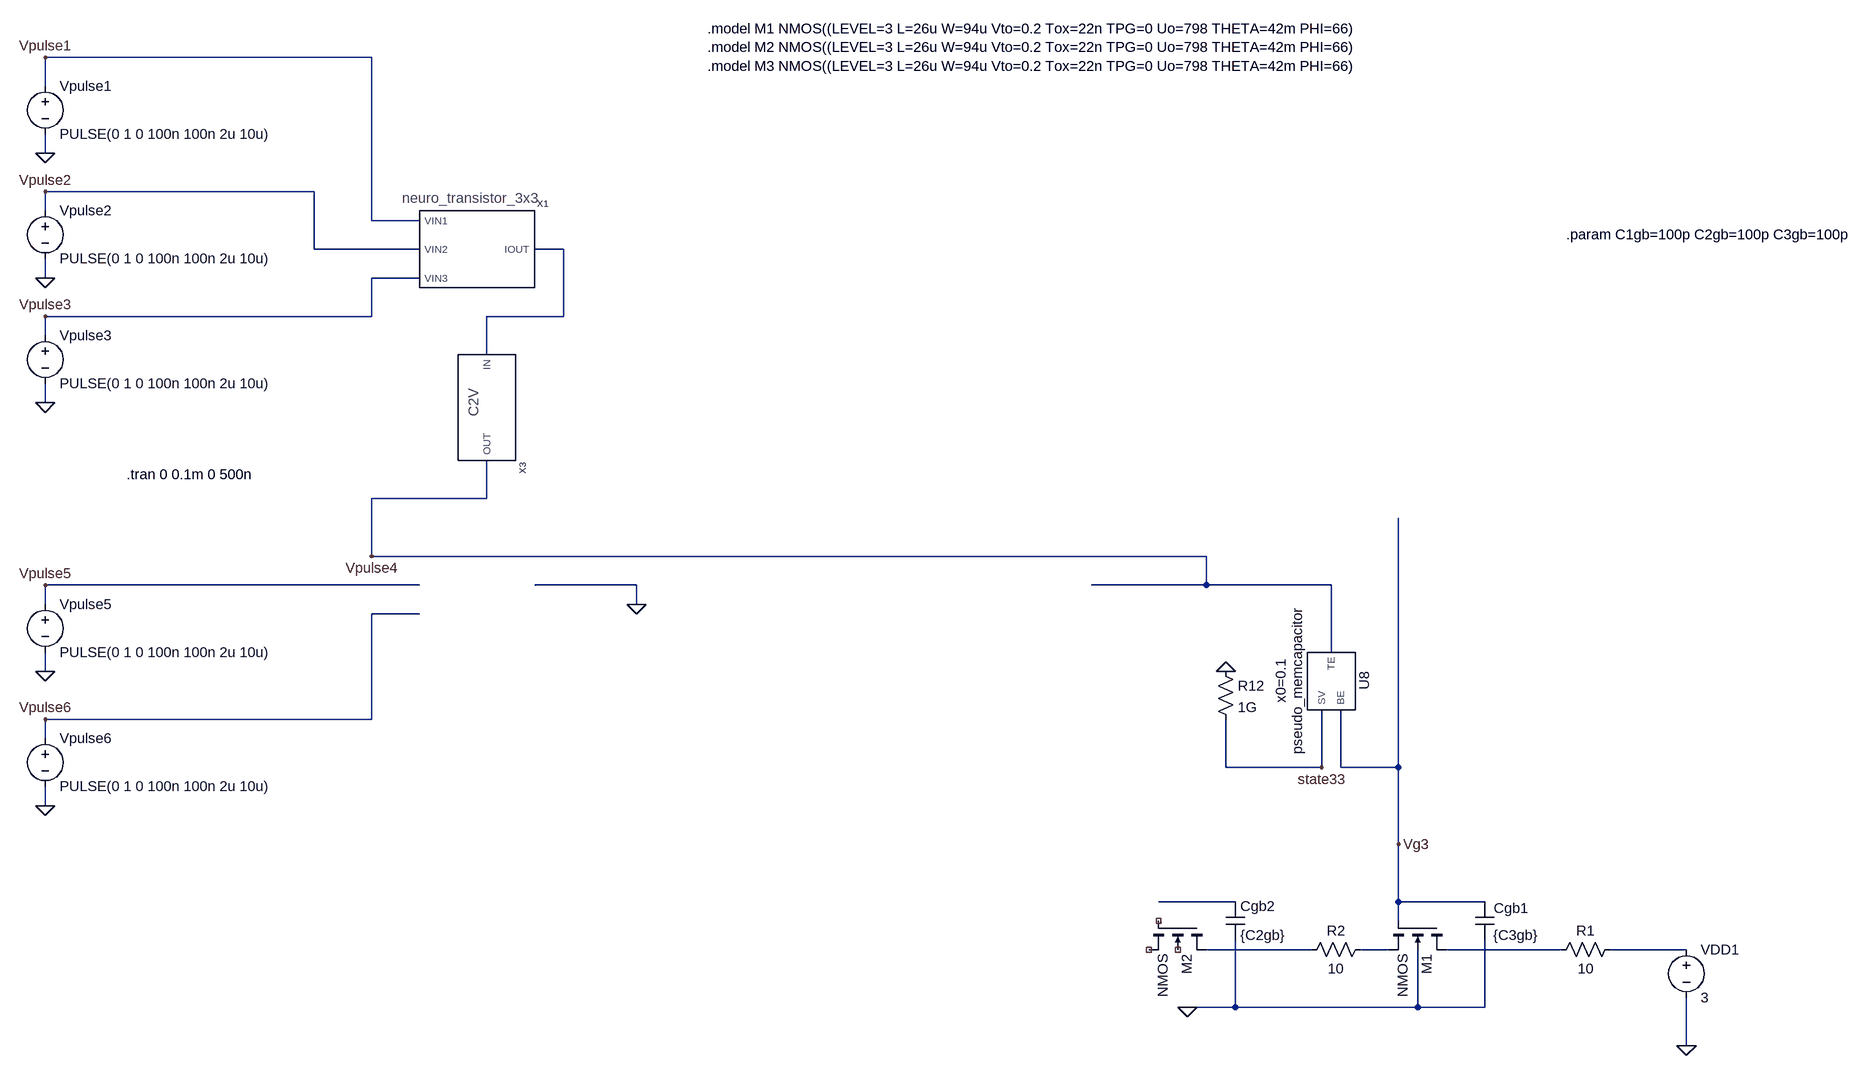
[diagram p0: schematic cascade_neuro_transistor_new.asc]
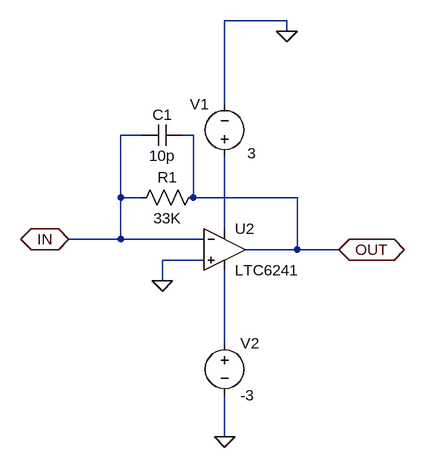
[diagram p1: sub-circuit current_to_voltage.asc]
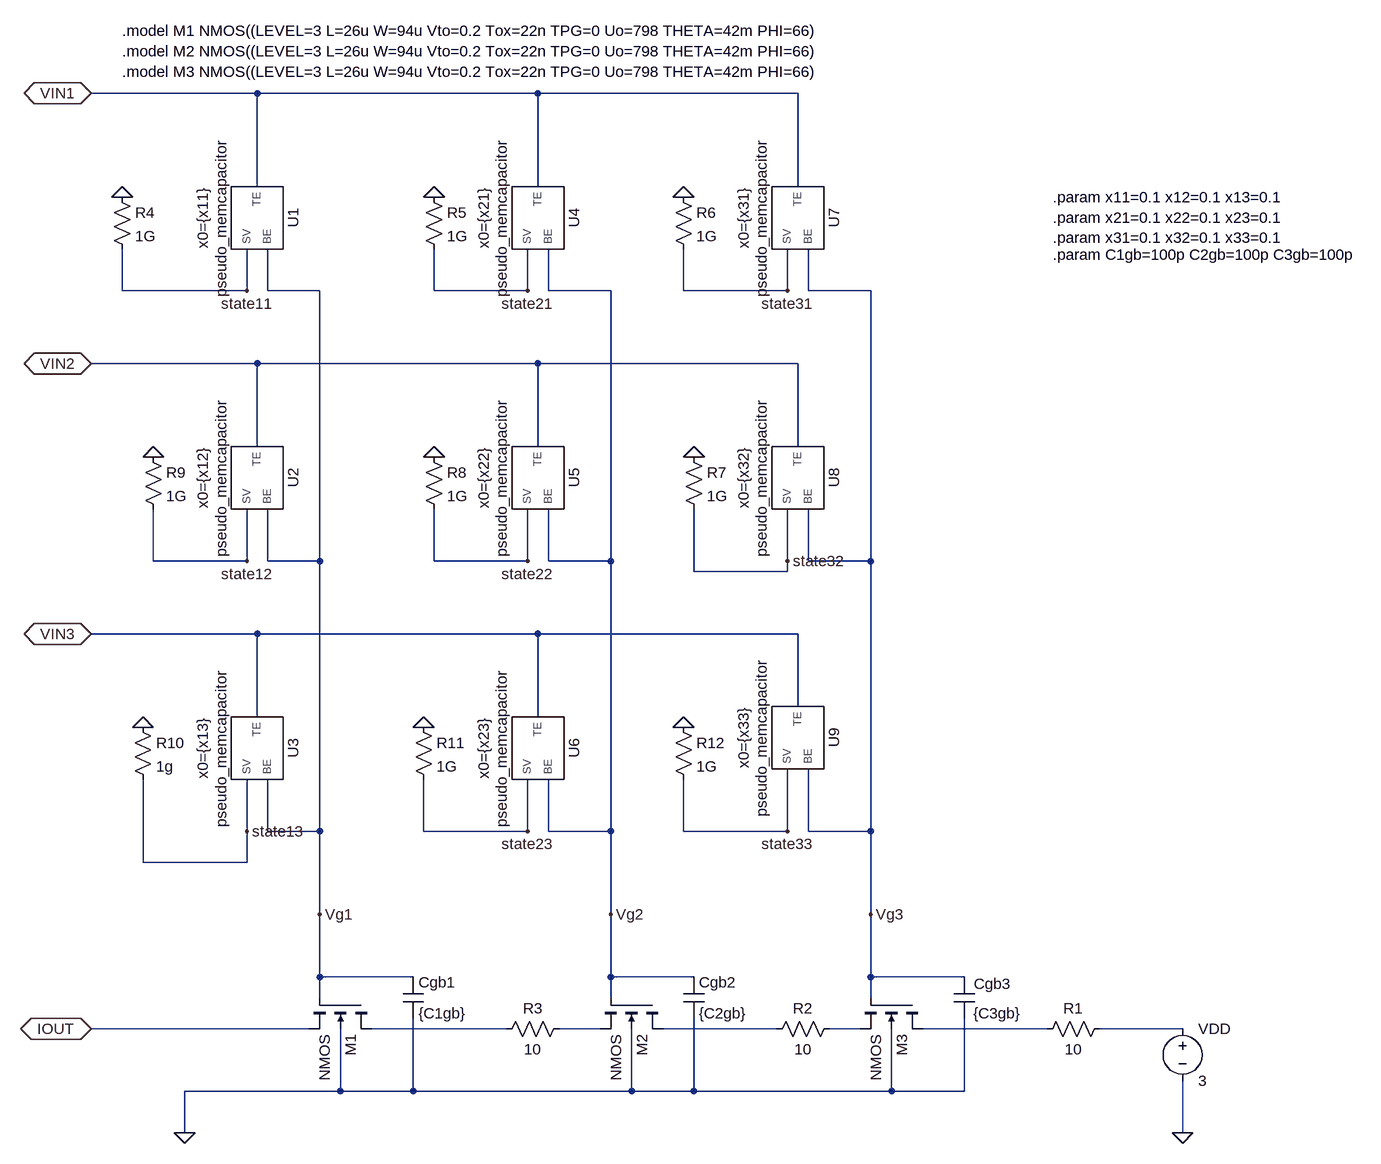
[diagram p2: sub-circuit neuro_memristor_3x3.asc]
cascade_neuro_transistor_new.asc, the LTspice schematic file:
Version 4
SHEET 1 3620 3476
WIRE 624 -16 80 -16
WIRE 80 32 80 -16
WIRE 80 144 80 112
WIRE 528 208 80 208
WIRE 80 240 80 208
WIRE 624 256 624 -16
WIRE 704 256 624 256
WIRE 528 304 528 208
WIRE 704 304 528 304
WIRE 944 304 896 304
WIRE 80 352 80 320
WIRE 704 352 624 352
WIRE 624 416 624 352
WIRE 624 416 80 416
WIRE 944 416 944 304
WIRE 944 416 816 416
WIRE 80 448 80 416
WIRE 816 480 816 416
WIRE 80 560 80 528
WIRE 816 720 816 656
WIRE 816 720 624 720
WIRE 624 816 624 720
WIRE 2256 816 624 816
WIRE 704 864 80 864
WIRE 1104 864 896 864
WIRE 2256 864 2256 816
WIRE 2256 864 2064 864
WIRE 2464 864 2256 864
WIRE 80 896 80 864
WIRE 1104 896 1104 864
WIRE 704 912 624 912
WIRE 2464 976 2464 864
WIRE 80 1008 80 976
WIRE 624 1088 624 912
WIRE 624 1088 80 1088
WIRE 80 1120 80 1088
WIRE 2288 1168 2288 1088
WIRE 2448 1168 2448 1072
WIRE 2448 1168 2288 1168
WIRE 2480 1168 2480 1072
WIRE 2576 1168 2576 752
WIRE 2576 1168 2480 1168
WIRE 80 1232 80 1200
WIRE 2576 1296 2576 1168
WIRE 2304 1392 2176 1392
WIRE 2576 1392 2576 1296
WIRE 2720 1392 2576 1392
WIRE 2576 1424 2576 1392
WIRE 2432 1472 2256 1472
WIRE 2560 1472 2512 1472
WIRE 2848 1472 2656 1472
WIRE 3056 1472 2928 1472
WIRE 2224 1568 2208 1568
WIRE 2304 1568 2304 1456
WIRE 2304 1568 2224 1568
WIRE 2608 1568 2608 1472
WIRE 2608 1568 2304 1568
WIRE 2720 1568 2720 1456
WIRE 2720 1568 2608 1568
WIRE 3056 1632 3056 1552
FLAG 80 144 0
FLAG 80 -16 Vpulse1
FLAG 80 352 0
FLAG 80 560 0
FLAG 80 208 Vpulse2
FLAG 80 416 Vpulse3
FLAG 80 1008 0
FLAG 80 1232 0
FLAG 80 864 Vpulse5
FLAG 80 1088 Vpulse6
FLAG 624 816 Vpulse4
FLAG 1104 896 0
FLAG 3056 1632 0
FLAG 2576 1296 Vg3
FLAG 2448 1168 state33
FLAG 2288 1008 0
FLAG 2224 1568 0
SYMBOL voltage 80 16 R0
WINDOW 123 0 0 Left 0
WINDOW 39 0 0 Left 0
SYMATTR InstName Vpulse1
SYMATTR Value PULSE(0 1 0 100n 100n 2u 10u)
SYMBOL voltage 80 224 R0
SYMATTR InstName Vpulse2
SYMATTR Value PULSE(0 1 0 100n 100n 2u 10u)
SYMBOL voltage 80 432 R0
SYMATTR InstName Vpulse3
SYMATTR Value PULSE(0 1 0 100n 100n 2u 10u)
SYMBOL voltage 80 880 R0
SYMATTR InstName Vpulse5
SYMATTR Value PULSE(0 1 0 100n 100n 2u 10u)
SYMBOL voltage 80 1104 R0
SYMATTR InstName Vpulse6
SYMATTR Value PULSE(0 1 0 100n 100n 2u 10u)
SYMBOL current_to_voltage 816 560 R90
SYMATTR InstName X3
SYMATTR SpiceModel C2V
SYMBOL neuro_memristor_3x3 800 304 R0
SYMATTR SpiceModel neuro_memristor_3x3
SYMATTR InstName X1
SYMBOL voltage 3056 1456 R0
SYMATTR InstName VDD1
SYMATTR Value 3
SYMBOL nmos4 2656 1424 R90
SYMATTR InstName M1
SYMBOL cap 2704 1392 R0
WINDOW 0 31 11 Left 2
WINDOW 3 30 56 Left 2
SYMATTR InstName Cgb1
SYMATTR Value {C3gb}
SYMBOL pseudo_memcapacitor 2464 1024 R90
WINDOW 123 0 68 Top 2
SYMATTR Value2 x0=0.1
SYMATTR InstName U8
SYMBOL nmos4 2256 1424 R90
SYMATTR InstName M2
SYMBOL cap 2288 1392 R0
SYMATTR InstName Cgb2
SYMATTR Value {C2gb}
SYMBOL res 2944 1456 R90
WINDOW 0 0 56 VBottom 2
WINDOW 3 32 56 VTop 2
SYMATTR InstName R1
SYMATTR Value 10
SYMBOL res 2528 1456 R90
WINDOW 0 0 56 VBottom 2
WINDOW 3 32 56 VTop 2
SYMATTR InstName R2
SYMATTR Value 10
SYMBOL res 2272 992 R0
SYMATTR InstName R12
SYMATTR Value 1G
TEXT 216 680 Left 2 !.tran 0 0.1m 0 500n
TEXT 1424 -64 Left 2 !.model M1 NMOS((LEVEL=3 L=26u W=94u Vto=0.2 Tox=22n TPG=0 Uo=798 THETA=42m PHI=66)\n.model M2 NMOS((LEVEL=3 L=26u W=94u Vto=0.2 Tox=22n TPG=0 Uo=798 THETA=42m PHI=66)\n.model M3 NMOS((LEVEL=3 L=26u W=94u Vto=0.2 Tox=22n TPG=0 Uo=798 THETA=42m PHI=66)
TEXT 2856 280 Left 2 !.param C1gb=100p C2gb=100p C3gb=100p

current_to_voltage.asc, the sub-circuit schematic file:
Version 4
SHEET 1 880 680
WIRE 320 -192 224 -192
WIRE 320 -176 320 -192
WIRE 224 -64 224 -192
WIRE 96 -16 64 -16
WIRE 176 -16 160 -16
WIRE 64 80 64 -16
WIRE 96 80 64 80
WIRE 176 80 176 -16
WIRE 336 80 176 80
WIRE 224 128 224 16
WIRE 64 144 64 80
WIRE 64 144 -16 144
WIRE 192 144 64 144
WIRE 336 160 336 80
WIRE 336 160 256 160
WIRE 400 160 336 160
WIRE 192 176 128 176
WIRE 128 208 128 176
WIRE 224 304 224 192
WIRE 224 448 224 384
FLAG 128 208 0
FLAG 320 -176 0
FLAG 224 448 0
FLAG -16 144 IN
IOPIN -16 144 BiDir
FLAG 400 160 OUT
IOPIN 400 160 BiDir
SYMBOL voltage 224 32 R180
WINDOW 0 24 96 Left 2
WINDOW 3 -49 20 Left 2
WINDOW 123 0 0 Left 0
WINDOW 39 0 0 Left 0
SYMATTR InstName V1
SYMATTR Value 3
SYMBOL voltage 224 288 R0
WINDOW 123 0 0 Left 0
WINDOW 39 0 0 Left 0
SYMATTR InstName V2
SYMATTR Value -3
SYMBOL res 192 64 R90
WINDOW 0 0 56 VBottom 2
WINDOW 3 32 56 VTop 2
SYMATTR InstName R1
SYMATTR Value 33K
SYMBOL OpAmps\\LTC6241 224 160 R0
SYMATTR InstName U2
SYMBOL cap 160 -32 R90
WINDOW 0 0 32 VBottom 2
WINDOW 3 32 32 VTop 2
SYMATTR InstName C1
SYMATTR Value 10p

neuro_memristor_3x3.asc, the sub-circuit schematic file:
Version 4
SHEET 1 2604 1572
WIRE 864 -208 608 -208
WIRE 1296 -208 864 -208
WIRE 1696 -208 1296 -208
WIRE 864 -64 864 -208
WIRE 1296 -64 1296 -208
WIRE 1696 -64 1696 -208
WIRE 656 96 656 32
WIRE 848 96 848 32
WIRE 848 96 656 96
WIRE 880 96 880 32
WIRE 960 96 880 96
WIRE 1136 96 1136 32
WIRE 1280 96 1280 32
WIRE 1280 96 1136 96
WIRE 1312 96 1312 32
WIRE 1408 96 1312 96
WIRE 1520 96 1520 32
WIRE 1680 96 1680 32
WIRE 1680 96 1520 96
WIRE 1712 96 1712 32
WIRE 1808 96 1712 96
WIRE 864 208 608 208
WIRE 1296 208 864 208
WIRE 1696 208 1296 208
WIRE 864 336 864 208
WIRE 1296 336 1296 208
WIRE 1696 336 1696 208
WIRE 704 512 704 432
WIRE 848 512 848 432
WIRE 848 512 704 512
WIRE 880 512 880 432
WIRE 960 512 960 96
WIRE 960 512 880 512
WIRE 1136 512 1136 432
WIRE 1280 512 1280 432
WIRE 1280 512 1136 512
WIRE 1312 512 1312 432
WIRE 1408 512 1408 96
WIRE 1408 512 1312 512
WIRE 1680 512 1680 432
WIRE 1712 512 1712 432
WIRE 1808 512 1808 96
WIRE 1808 512 1712 512
WIRE 1536 528 1536 432
WIRE 1680 528 1680 512
WIRE 1680 528 1536 528
WIRE 864 624 608 624
WIRE 1296 624 864 624
WIRE 1696 624 1296 624
WIRE 1696 736 1696 624
WIRE 864 752 864 624
WIRE 1296 752 1296 624
WIRE 848 928 848 848
WIRE 880 928 880 848
WIRE 960 928 960 512
WIRE 960 928 880 928
WIRE 1120 928 1120 848
WIRE 1280 928 1280 848
WIRE 1280 928 1120 928
WIRE 1312 928 1312 848
WIRE 1408 928 1408 512
WIRE 1408 928 1312 928
WIRE 1520 928 1520 848
WIRE 1680 928 1680 832
WIRE 1680 928 1520 928
WIRE 1712 928 1712 832
WIRE 1808 928 1808 512
WIRE 1808 928 1712 928
WIRE 688 976 688 848
WIRE 848 976 848 928
WIRE 848 976 688 976
WIRE 960 1056 960 928
WIRE 1408 1056 1408 928
WIRE 1808 1056 1808 928
WIRE 960 1152 960 1056
WIRE 1104 1152 960 1152
WIRE 1408 1152 1408 1056
WIRE 1536 1152 1408 1152
WIRE 1808 1152 1808 1056
WIRE 1952 1152 1808 1152
WIRE 960 1184 960 1152
WIRE 1408 1184 1408 1152
WIRE 1808 1184 1808 1152
WIRE 944 1232 608 1232
WIRE 1248 1232 1040 1232
WIRE 1392 1232 1328 1232
WIRE 1664 1232 1488 1232
WIRE 1792 1232 1744 1232
WIRE 2080 1232 1888 1232
WIRE 2288 1232 2160 1232
WIRE 992 1328 992 1232
WIRE 992 1328 752 1328
WIRE 1104 1328 1104 1216
WIRE 1104 1328 992 1328
WIRE 1440 1328 1440 1232
WIRE 1440 1328 1104 1328
WIRE 1536 1328 1536 1216
WIRE 1536 1328 1440 1328
WIRE 1840 1328 1840 1232
WIRE 1840 1328 1536 1328
WIRE 1952 1328 1952 1216
WIRE 1952 1328 1840 1328
WIRE 752 1392 752 1328
WIRE 2288 1392 2288 1312
FLAG 2288 1392 0
FLAG 1808 1056 Vg3
FLAG 848 512 state12
FLAG 848 928 state13
FLAG 1408 1056 Vg2
FLAG 960 1056 Vg1
FLAG 1280 96 state21
FLAG 1280 512 state22
FLAG 1280 928 state23
FLAG 1680 96 state31
FLAG 1680 512 state32
FLAG 1680 928 state33
FLAG 752 1392 0
FLAG 608 -208 VIN1
IOPIN 608 -208 BiDir
FLAG 608 208 VIN2
IOPIN 608 208 BiDir
FLAG 608 624 VIN3
IOPIN 608 624 BiDir
FLAG 608 1232 IOUT
IOPIN 608 1232 BiDir
FLAG 848 96 state11
FLAG 656 -48 0
FLAG 1136 -48 0
FLAG 1520 -48 0
FLAG 1536 352 0
FLAG 1136 352 0
FLAG 704 352 0
FLAG 688 768 0
FLAG 1120 768 0
FLAG 1520 768 0
SYMBOL voltage 2288 1216 R0
SYMATTR InstName VDD
SYMATTR Value 3
SYMBOL nmos4 1888 1184 R90
SYMATTR InstName M3
SYMBOL cap 1936 1152 R0
WINDOW 0 31 11 Left 2
WINDOW 3 30 56 Left 2
SYMATTR InstName Cgb3
SYMATTR Value {C3gb}
SYMBOL pseudo_memcapacitor 864 384 R90
WINDOW 123 0 68 Top 2
SYMATTR Value2 x0={x12}
SYMATTR InstName U2
SYMBOL pseudo_memcapacitor 864 800 R90
WINDOW 123 0 68 Top 2
SYMATTR Value2 x0={x13}
SYMATTR InstName U3
SYMBOL pseudo_memcapacitor 1296 -16 R90
WINDOW 123 0 68 Top 2
SYMATTR Value2 x0={x21}
SYMATTR InstName U4
SYMBOL pseudo_memcapacitor 1296 384 R90
WINDOW 123 0 68 Top 2
SYMATTR Value2 x0={x22}
SYMATTR InstName U5
SYMBOL pseudo_memcapacitor 1296 800 R90
WINDOW 123 0 68 Top 2
SYMATTR Value2 x0={x23}
SYMATTR InstName U6
SYMBOL pseudo_memcapacitor 1696 -16 R90
WINDOW 123 0 68 Top 2
SYMATTR Value2 x0={x31}
SYMATTR InstName U7
SYMBOL pseudo_memcapacitor 1696 384 R90
WINDOW 123 0 68 Top 2
SYMATTR Value2 x0={x32}
SYMATTR InstName U8
SYMBOL pseudo_memcapacitor 1696 784 R90
WINDOW 123 0 68 Top 2
SYMATTR Value2 x0={x33}
SYMATTR InstName U9
SYMBOL nmos4 1488 1184 R90
SYMATTR InstName M2
SYMBOL nmos4 1040 1184 R90
SYMATTR InstName M1
SYMBOL cap 1520 1152 R0
SYMATTR InstName Cgb2
SYMATTR Value {C2gb}
SYMBOL cap 1088 1152 R0
SYMATTR InstName Cgb1
SYMATTR Value {C1gb}
SYMBOL res 2176 1216 R90
WINDOW 0 0 56 VBottom 2
WINDOW 3 32 56 VTop 2
SYMATTR InstName R1
SYMATTR Value 10
SYMBOL res 1760 1216 R90
WINDOW 0 0 56 VBottom 2
WINDOW 3 32 56 VTop 2
SYMATTR InstName R2
SYMATTR Value 10
SYMBOL res 1344 1216 R90
WINDOW 0 0 56 VBottom 2
WINDOW 3 32 56 VTop 2
SYMATTR InstName R3
SYMATTR Value 10
SYMBOL pseudo_memcapacitor 864 -16 R90
WINDOW 123 0 68 Top 2
SYMATTR Value2 x0={x11}
SYMATTR InstName U1
SYMBOL res 640 -64 R0
SYMATTR InstName R4
SYMATTR Value 1G
SYMBOL res 1120 -64 R0
SYMATTR InstName R5
SYMATTR Value 1G
SYMBOL res 1504 -64 R0
SYMATTR InstName R6
SYMATTR Value 1G
SYMBOL res 1520 336 R0
SYMATTR InstName R7
SYMATTR Value 1G
SYMBOL res 1120 336 R0
SYMATTR InstName R8
SYMATTR Value 1G
SYMBOL res 688 336 R0
SYMATTR InstName R9
SYMATTR Value 1G
SYMBOL res 672 752 R0
SYMATTR InstName R10
SYMATTR Value 1g
SYMBOL res 1104 752 R0
SYMATTR InstName R11
SYMATTR Value 1G
SYMBOL res 1504 752 R0
SYMATTR InstName R12
SYMATTR Value 1G
TEXT 656 -304 Left 2 !.model M1 NMOS((LEVEL=3 L=26u W=94u Vto=0.2 Tox=22n TPG=0 Uo=798 THETA=42m PHI=66)\n.model M2 NMOS((LEVEL=3 L=26u W=94u Vto=0.2 Tox=22n TPG=0 Uo=798 THETA=42m PHI=66)\n.model M3 NMOS((LEVEL=3 L=26u W=94u Vto=0.2 Tox=22n TPG=0 Uo=798 THETA=42m PHI=66)
TEXT 2088 -48 Left 2 !.param x11=0.1 x12=0.1 x13=0.1\n.param x21=0.1 x22=0.1 x23=0.1\n.param x31=0.1 x32=0.1 x33=0.1
TEXT 2088 40 Left 2 !.param C1gb=100p C2gb=100p C3gb=100p

The netlist it stands for:
* cascade_neuro_transistor_new.asc
Vpulse1 Vpulse1 0 PULSE(0 1 0 100n 100n 2u 10u)
Vpulse2 Vpulse2 0 PULSE(0 1 0 100n 100n 2u 10u)
Vpulse3 Vpulse3 0 PULSE(0 1 0 100n 100n 2u 10u)
Vpulse5 Vpulse5 0 PULSE(0 1 0 100n 100n 2u 10u)
Vpulse6 Vpulse6 0 PULSE(0 1 0 100n 100n 2u 10u)
XX3 N001 Vpulse4 current_to_voltage params: current_to_voltage
XX1 Vpulse1 Vpulse2 Vpulse3 N001 neuro_memristor_3x3 params: neuro_memristor_3x3
VDD1 N006 0 3
M1 N005 Vg3 N004 0 NMOS
Cgb1 Vg3 0 {C3gb}
XU8 Vpulse4 Vg3 state33 pseudo_memcapacitor x0=0.1  ; pins TE BE SV
M2 N003 NC_01 NC_02 NC_03 NMOS
Cgb2 N002 0 {C2gb}
R1 N006 N005 10
R2 N004 N003 10
R12 0 state33 1G

* block symbol definitions
.subckt current_to_voltage IN OUT
V1 N001 0 3
V2 N002 0 -3
R1 OUT IN 33K
XU2 0 IN N001 N002 OUT LTC6241  ; pins In+ In- V+ V- OUT
C1 OUT IN 10p
.ends current_to_voltage

.subckt neuro_memristor_3x3 VIN1 VIN2 VIN3 IOUT
VDD N006 0 3
M3 N005 Vg3 N004 0 NMOS
Cgb3 Vg3 0 {C3gb}
XU2 VIN2 Vg1 state12 pseudo_memcapacitor x0={x12}  ; pins TE BE SV
XU3 VIN3 Vg1 state13 pseudo_memcapacitor x0={x13}  ; pins TE BE SV
XU4 VIN1 Vg2 state21 pseudo_memcapacitor x0={x21}  ; pins TE BE SV
XU5 VIN2 Vg2 state22 pseudo_memcapacitor x0={x22}  ; pins TE BE SV
XU6 VIN3 Vg2 state23 pseudo_memcapacitor x0={x23}  ; pins TE BE SV
XU7 VIN1 Vg3 state31 pseudo_memcapacitor x0={x31}  ; pins TE BE SV
XU8 VIN2 Vg3 state32 pseudo_memcapacitor x0={x32}  ; pins TE BE SV
XU9 VIN3 Vg3 state33 pseudo_memcapacitor x0={x33}  ; pins TE BE SV
M2 N003 Vg2 N002 0 NMOS
M1 N001 Vg1 IOUT 0 NMOS
Cgb2 Vg2 0 {C2gb}
Cgb1 Vg1 0 {C1gb}
R1 N006 N005 10
R2 N004 N003 10
R3 N002 N001 10
XU1 VIN1 Vg1 state11 pseudo_memcapacitor x0={x11}  ; pins TE BE SV
R4 0 state11 1G
R5 0 state21 1G
R6 0 state31 1G
R7 0 state32 1G
R8 0 state22 1G
R9 0 state12 1G
R10 0 state13 1g
R11 0 state23 1G
R12 0 state33 1G
.model M1 NMOS((LEVEL=3 L=26u W=94u Vto=0.2 Tox=22n TPG=0 Uo=798 THETA=42m PHI=66)
.model M2 NMOS((LEVEL=3 L=26u W=94u Vto=0.2 Tox=22n TPG=0 Uo=798 THETA=42m PHI=66)
.model M3 NMOS((LEVEL=3 L=26u W=94u Vto=0.2 Tox=22n TPG=0 Uo=798 THETA=42m PHI=66)
.param x11=0.1 x12=0.1 x13=0.1
.param x21=0.1 x22=0.1 x23=0.1
.param x31=0.1 x32=0.1 x33=0.1
.param C1gb=100p C2gb=100p C3gb=100p
.ends neuro_memristor_3x3

.model NMOS NMOS
.model PMOS PMOS
.lib standard.mos
.tran 0 0.1m 0 500n
.model M1 NMOS((LEVEL=3 L=26u W=94u Vto=0.2 Tox=22n TPG=0 Uo=798 THETA=42m PHI=66)
.model M2 NMOS((LEVEL=3 L=26u W=94u Vto=0.2 Tox=22n TPG=0 Uo=798 THETA=42m PHI=66)
.model M3 NMOS((LEVEL=3 L=26u W=94u Vto=0.2 Tox=22n TPG=0 Uo=798 THETA=42m PHI=66)
.param C1gb=100p C2gb=100p C3gb=100p
.lib ./current_to_voltage.asc
.lib LTC4.lib
.lib ./neuro_memristor_3x3.asc
.lib pseudo_memcapacitor.cir
.backanno
.end

* Results of the author's LTspice run, read from the files saved beside the schematic
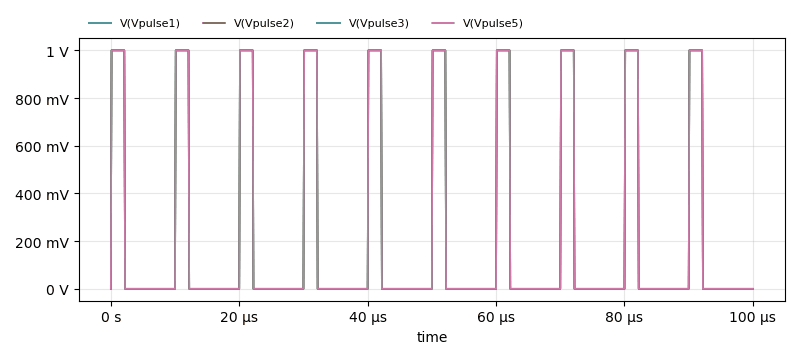
[diagram p3: Transient Analysis of cascade_neuro_transistor_new.asc, plotted from the saved traces]
* Transient Analysis, 1 run:
*   V(Vpulse1): min 0 V, max 1 V, average 210 mV, rms 454.7 mV, last 0 V
*   V(Vpulse2): min 0 V, max 1 V, average 210 mV, rms 454.7 mV, last 0 V
*   V(Vpulse3): min 0 V, max 1 V, average 210 mV, rms 454.7 mV, last 0 V
*   V(Vpulse5): min 0 V, max 1 V, average 210 mV, rms 454.7 mV, last 0 V